# EAGLE design telakone-aux-gps (EAGLE 7.7.0)

## Sheet 1 of 5: POWER
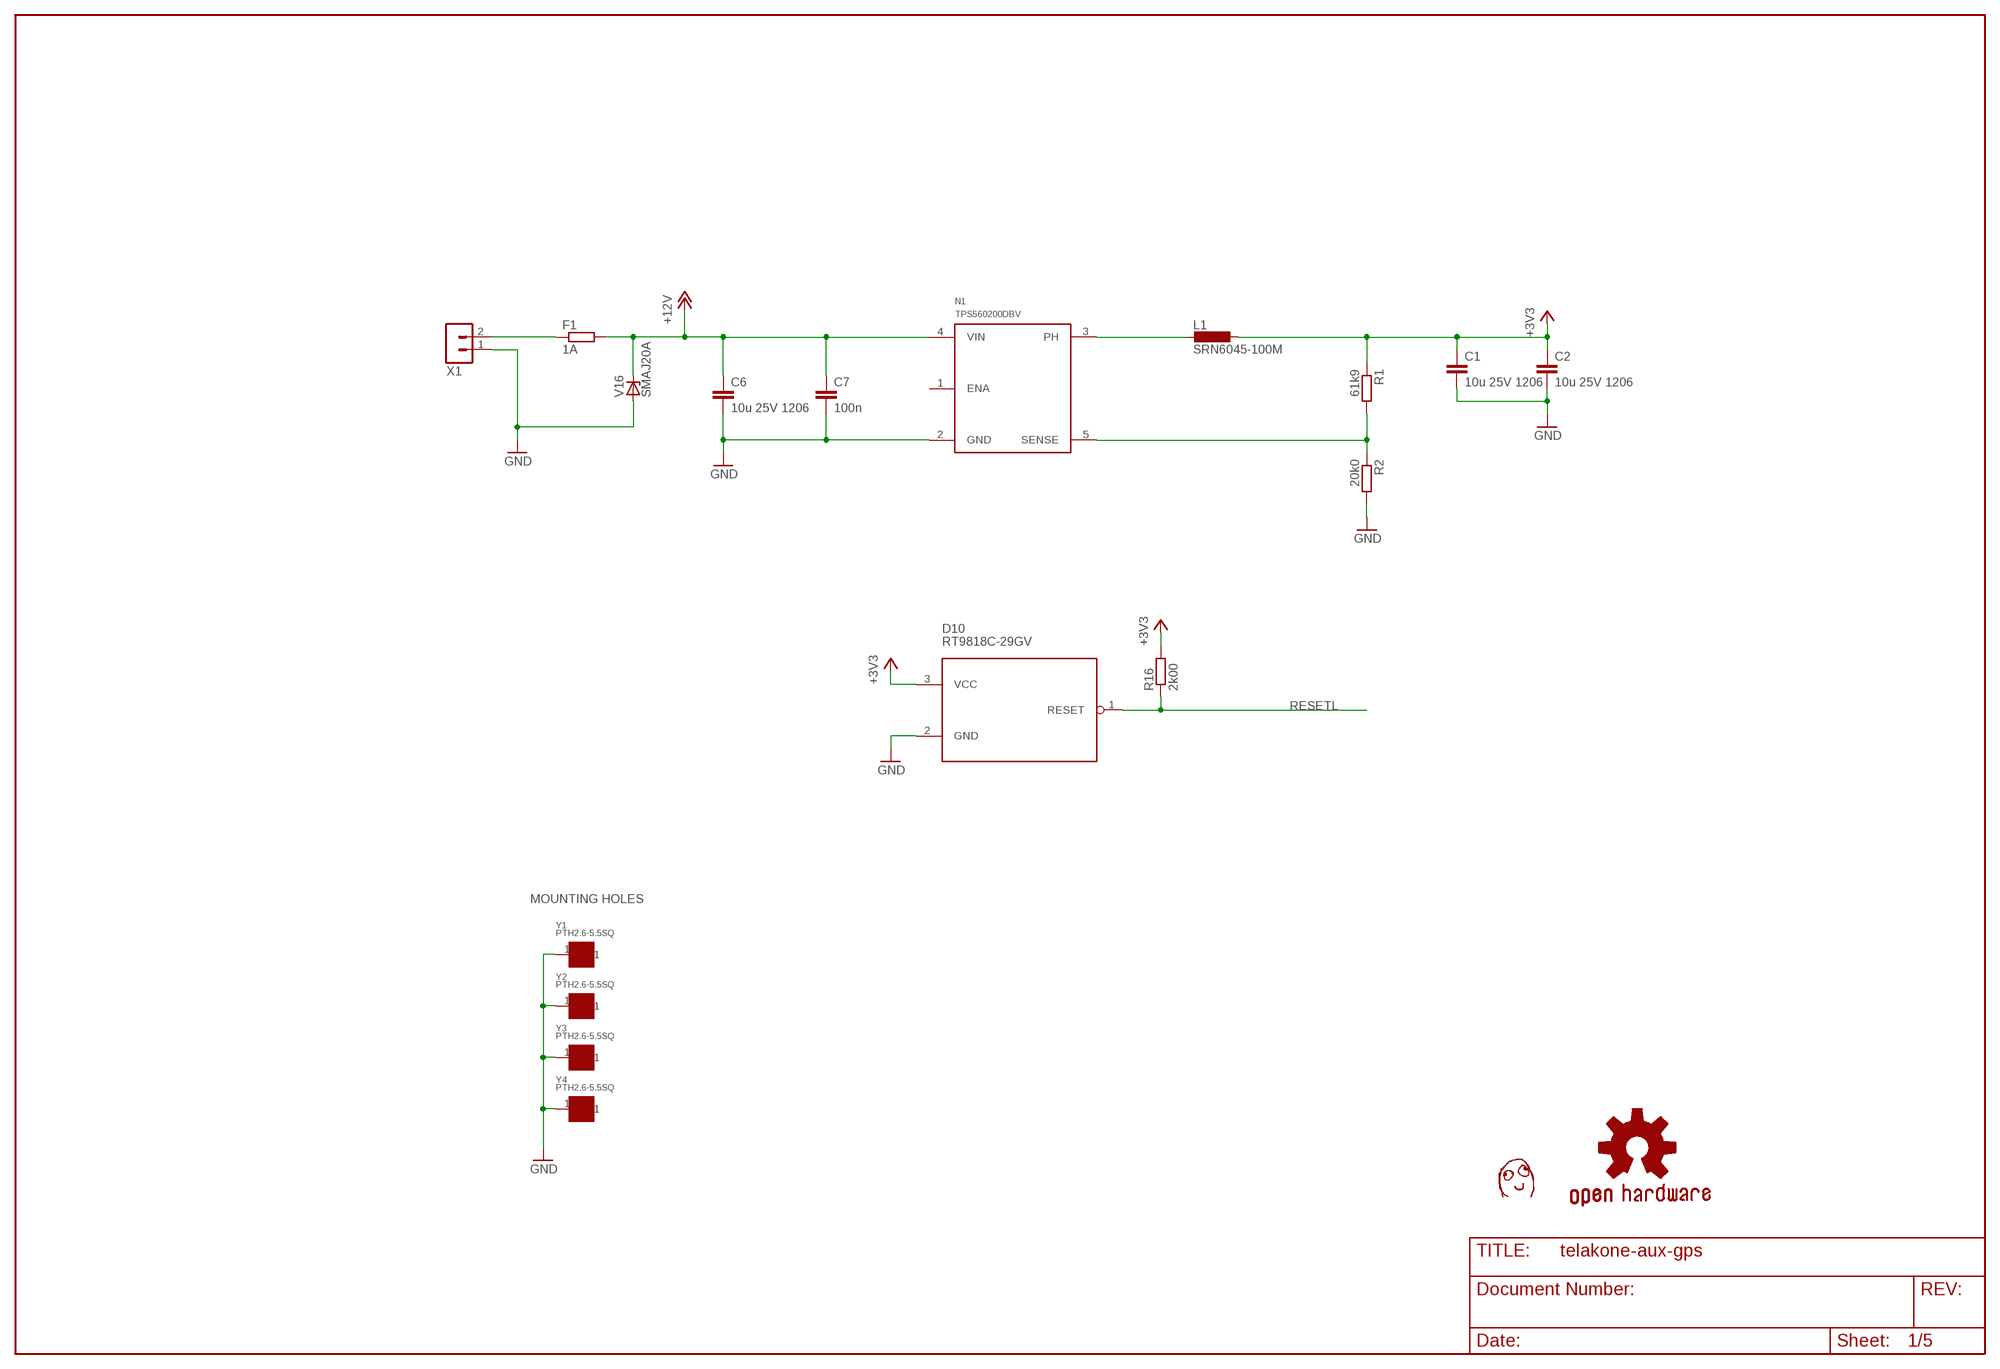
[diagram p0: schematic, sheet 1]

### Parts
C1  10u 25V 1206  CAP1206  [C1206]
C2  10u 25V 1206  CAP1206  [C1206]
C6  10u 25V 1206  CAP1206  [C1206]
C7  100n  CAP0603  [C0603]
D10  RT9818C-29GV  [SOT23]
F1  1A  RES1206  [R1206]
L1  SRN6045-100M  [SRN6045]
N1  TPS560200DBV  [SOT95P280X145-5N]
R1  61k9  RES0603  [R0603]
R2  20k0  RES0603  [R0603]
R16  2k00  RES0603  [R0603]
U$5  DAFUG  [DAFUG]
V16  SMAJ20A  SMAJXXA  [DO214AC]
X1  TE_RUUVILIITIN2  [TE_RUUVILIITIN2]
Y1  PTH2.6-5.5SQ  [PTH-2.6-5.5SQ]
Y2  PTH2.6-5.5SQ  [PTH-2.6-5.5SQ]
Y3  PTH2.6-5.5SQ  [PTH-2.6-5.5SQ]
Y4  PTH2.6-5.5SQ  [PTH-2.6-5.5SQ]

### Nets
+3V3 [supply]: C1.1 C2.1 D10.3(VCC) L1.1 R1.1 R16.2 ; also sheet 2,3,4,5
+12V [power]: C6.1 C7.1 F1.2 N1.4(VIN) V16.C ; also sheet 2,3
+12V_IN [power]: F1.1 X1.2
GND [other]: C1.2 C2.2 C6.2 C7.2 D10.2(GND) N1.2(GND) R2.2 V16.A X1.1 Y1.1 Y2.1 Y3.1 Y4.1 ; also sheet 2,3,4,5
N1_PHASE: L1.2 N1.3(PH)
N1_SENSE: N1.5(SENSE) R1.2 R2.1
RESETL: D10.1(RESET) R16.1 ; also sheet 3
Unconnected: N1.1(ENA)

### Notes on the sheet
- MOUNTING HOLES

## Sheet 2 of 5: IO
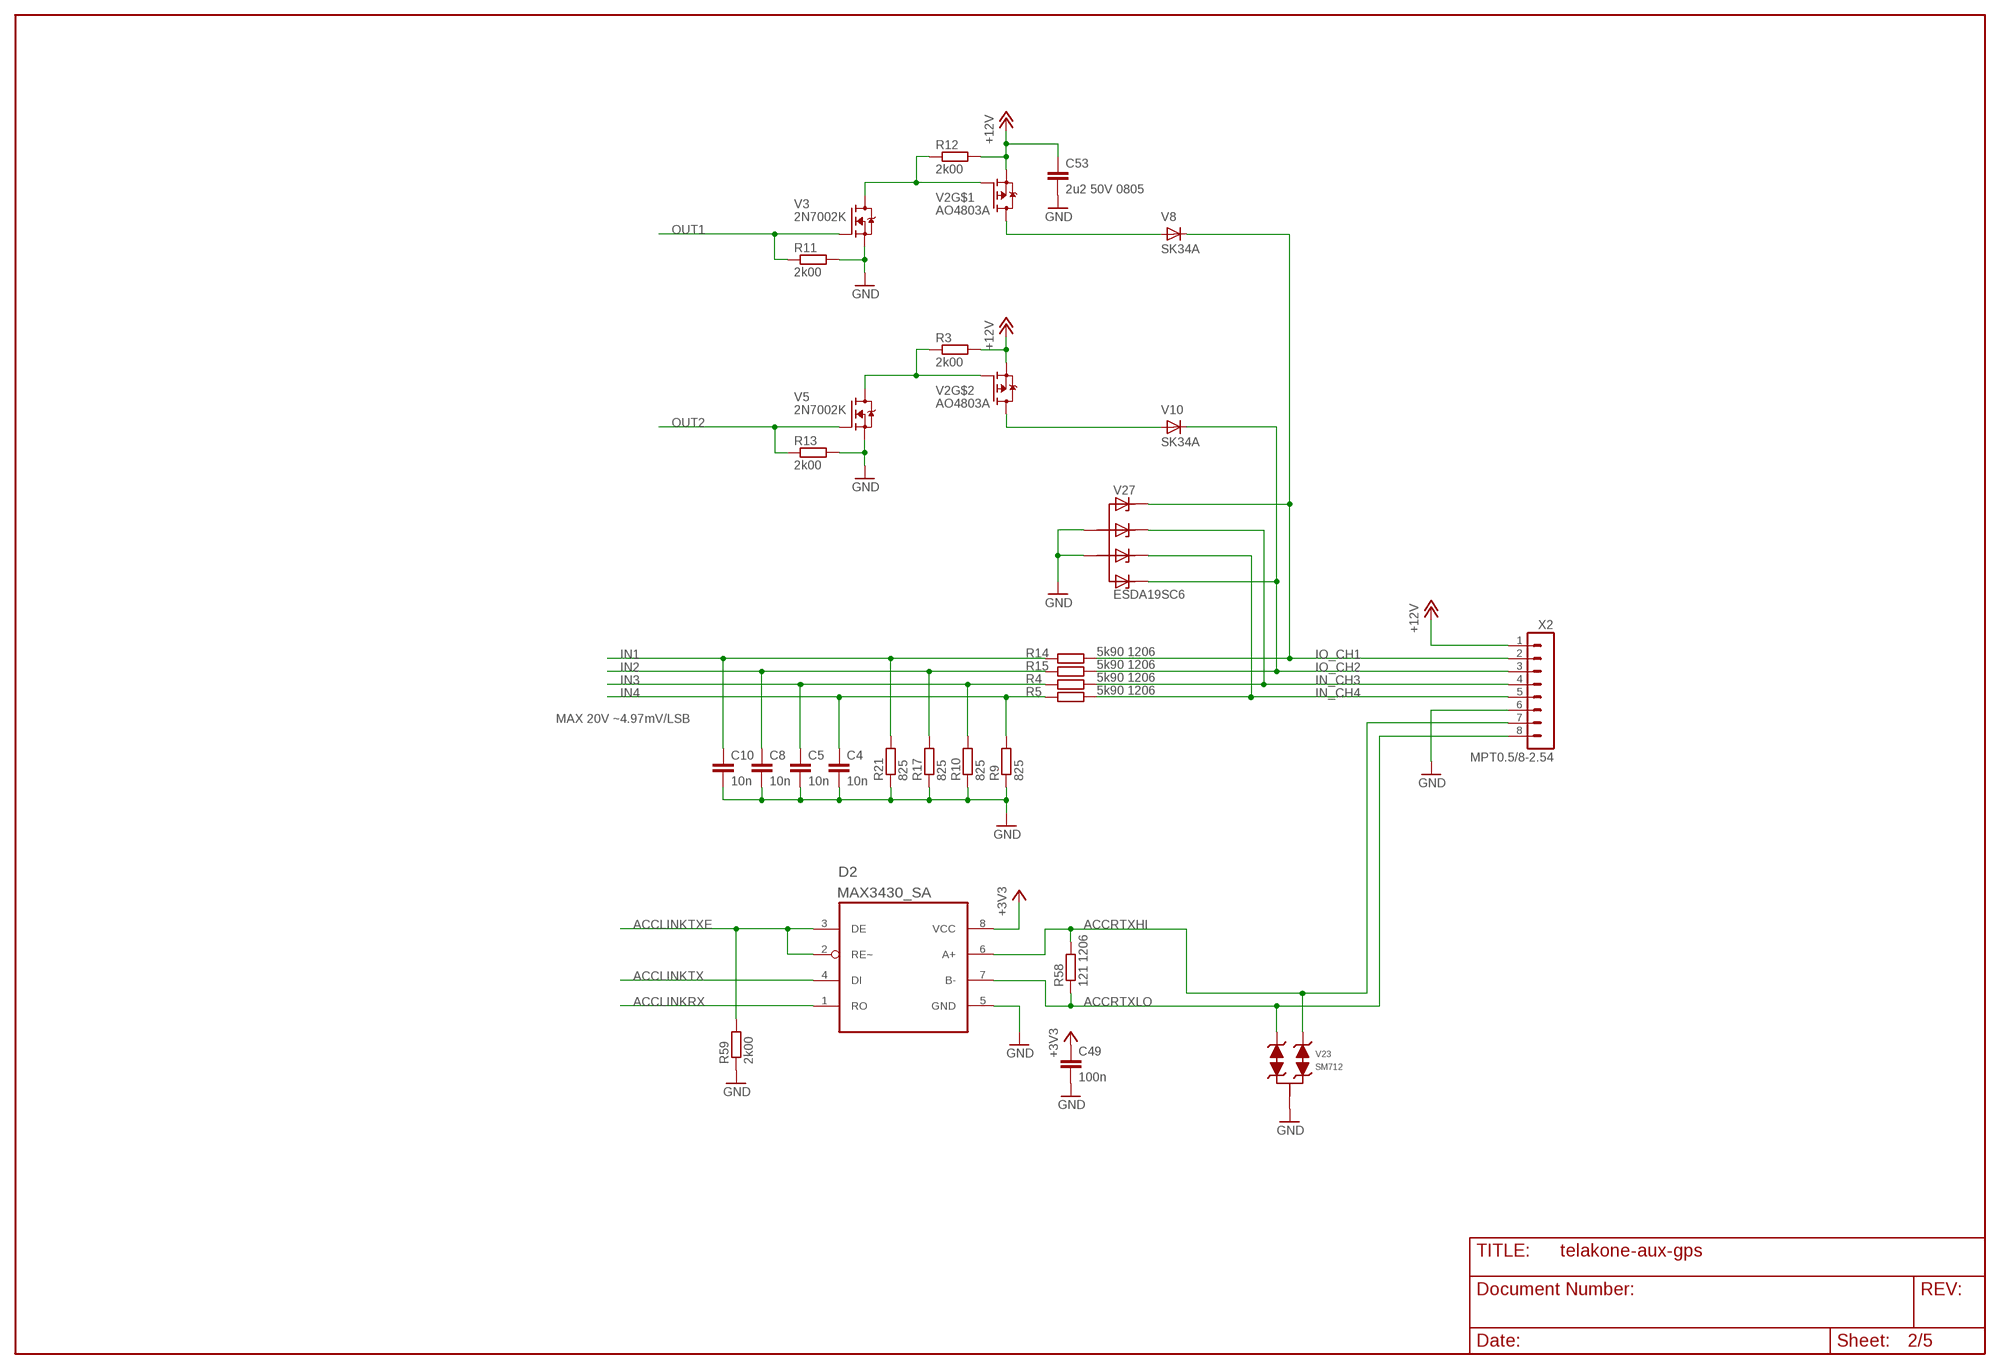
[diagram p1: schematic, sheet 2]

### Parts
C4  10n  CAP0603  [C0603]
C5  10n  CAP0603  [C0603]
C8  10n  CAP0603  [C0603]
C10  10n  CAP0603  [C0603]
C49  100n  CAP0603  [C0603]
C53  2u2 50V 0805  CAP0805  [C0805]
D2  MAX3430_SA  MAX3088_SA  [SOIC8-N_MC]
R3  2k00  RES0603  [R0603]
R4  5k90 1206  RES1206  [R1206]
R5  5k90 1206  RES1206  [R1206]
R9  825  RES0603  [R0603]
R10  825  RES0603  [R0603]
R11  2k00  RES0603  [R0603]
R12  2k00  RES0603  [R0603]
R13  2k00  RES0603  [R0603]
R14  5k90 1206  RES1206  [R1206]
R15  5k90 1206  RES1206  [R1206]
R17  825  RES0603  [R0603]
R21  825  RES0603  [R0603]
R58  121 1206  RES1206  [R1206]
R59  2k00  RES0603  [R0603]
V2  AO4803A  [SOIC8-N_MC]
V3  2N7002K  [SOT23]
V5  2N7002K  [SOT23]
V8  SK34A  [DO214AC]
V10  SK34A  [DO214AC]
V23  SM712  [SOT23]
V27  ESDA19SC6  ESDAXXSC6  [SOT23-6]
X2  MPT0.5/8-2.54  [MPT0.5/8-2.54]

### Nets
+3V3 [supply]: C49.1 D2.8(VCC) ; also sheet 1,3,4,5
+12V [power]: C53.1 R3.2 R12.2 V2.1(S) V2.3(S) X2.1 ; also sheet 1,3
ACCLINKRX: D2.1(RO) ; also sheet 4
ACCLINKTX: D2.4(DI) ; also sheet 4
ACCLINKTXE: D2.2(RE~) D2.3(DE) R59.2 ; also sheet 4
ACCRTXHI: D2.6(A+) R58.2 V23.1 X2.7
ACCRTXLO: D2.7(B-) R58.1 V23.2 X2.8
GND [other]: C4.2 C5.2 C8.2 C10.2 C49.2 C53.2 D2.5(GND) R9.1 R10.1 R11.2 R13.2 R17.1 R21.1 R59.1 V3.2(S) V5.2(S) V23.3 V27.2(A) V27.5(A1) X2.6 ; also sheet 1,3,4,5
IN1: C10.1 R14.1 R21.2 ; also sheet 4
IN2: C8.1 R15.1 R17.2 ; also sheet 4
IN3: C5.1 R4.1 R10.2 ; also sheet 4
IN4: C4.1 R5.1 R9.2 ; also sheet 4
IN_CH3: R4.2 V27.3(C1) X2.4
IN_CH4: R5.2 V27.4(C2) X2.5
IO_CH1: R14.2 V8.C V27.1(C) X2.2
IO_CH2: R15.2 V10.C V27.6(C3) X2.3
N$10: R3.1 V2.2(G) V5.3(D)
N$11: R12.1 V2.4(G) V3.3(D)
NERT: V2.5(D) V2.6(D) V8.A
NERT1: V2.7(D) V2.8(D) V10.A
OUT1: R11.1 V3.1(G) ; also sheet 4
OUT2: R13.1 V5.1(G) ; also sheet 4

### Notes on the sheet
- MAX 20V ~4.97mV/LSB

## Sheet 3 of 5: CPU1
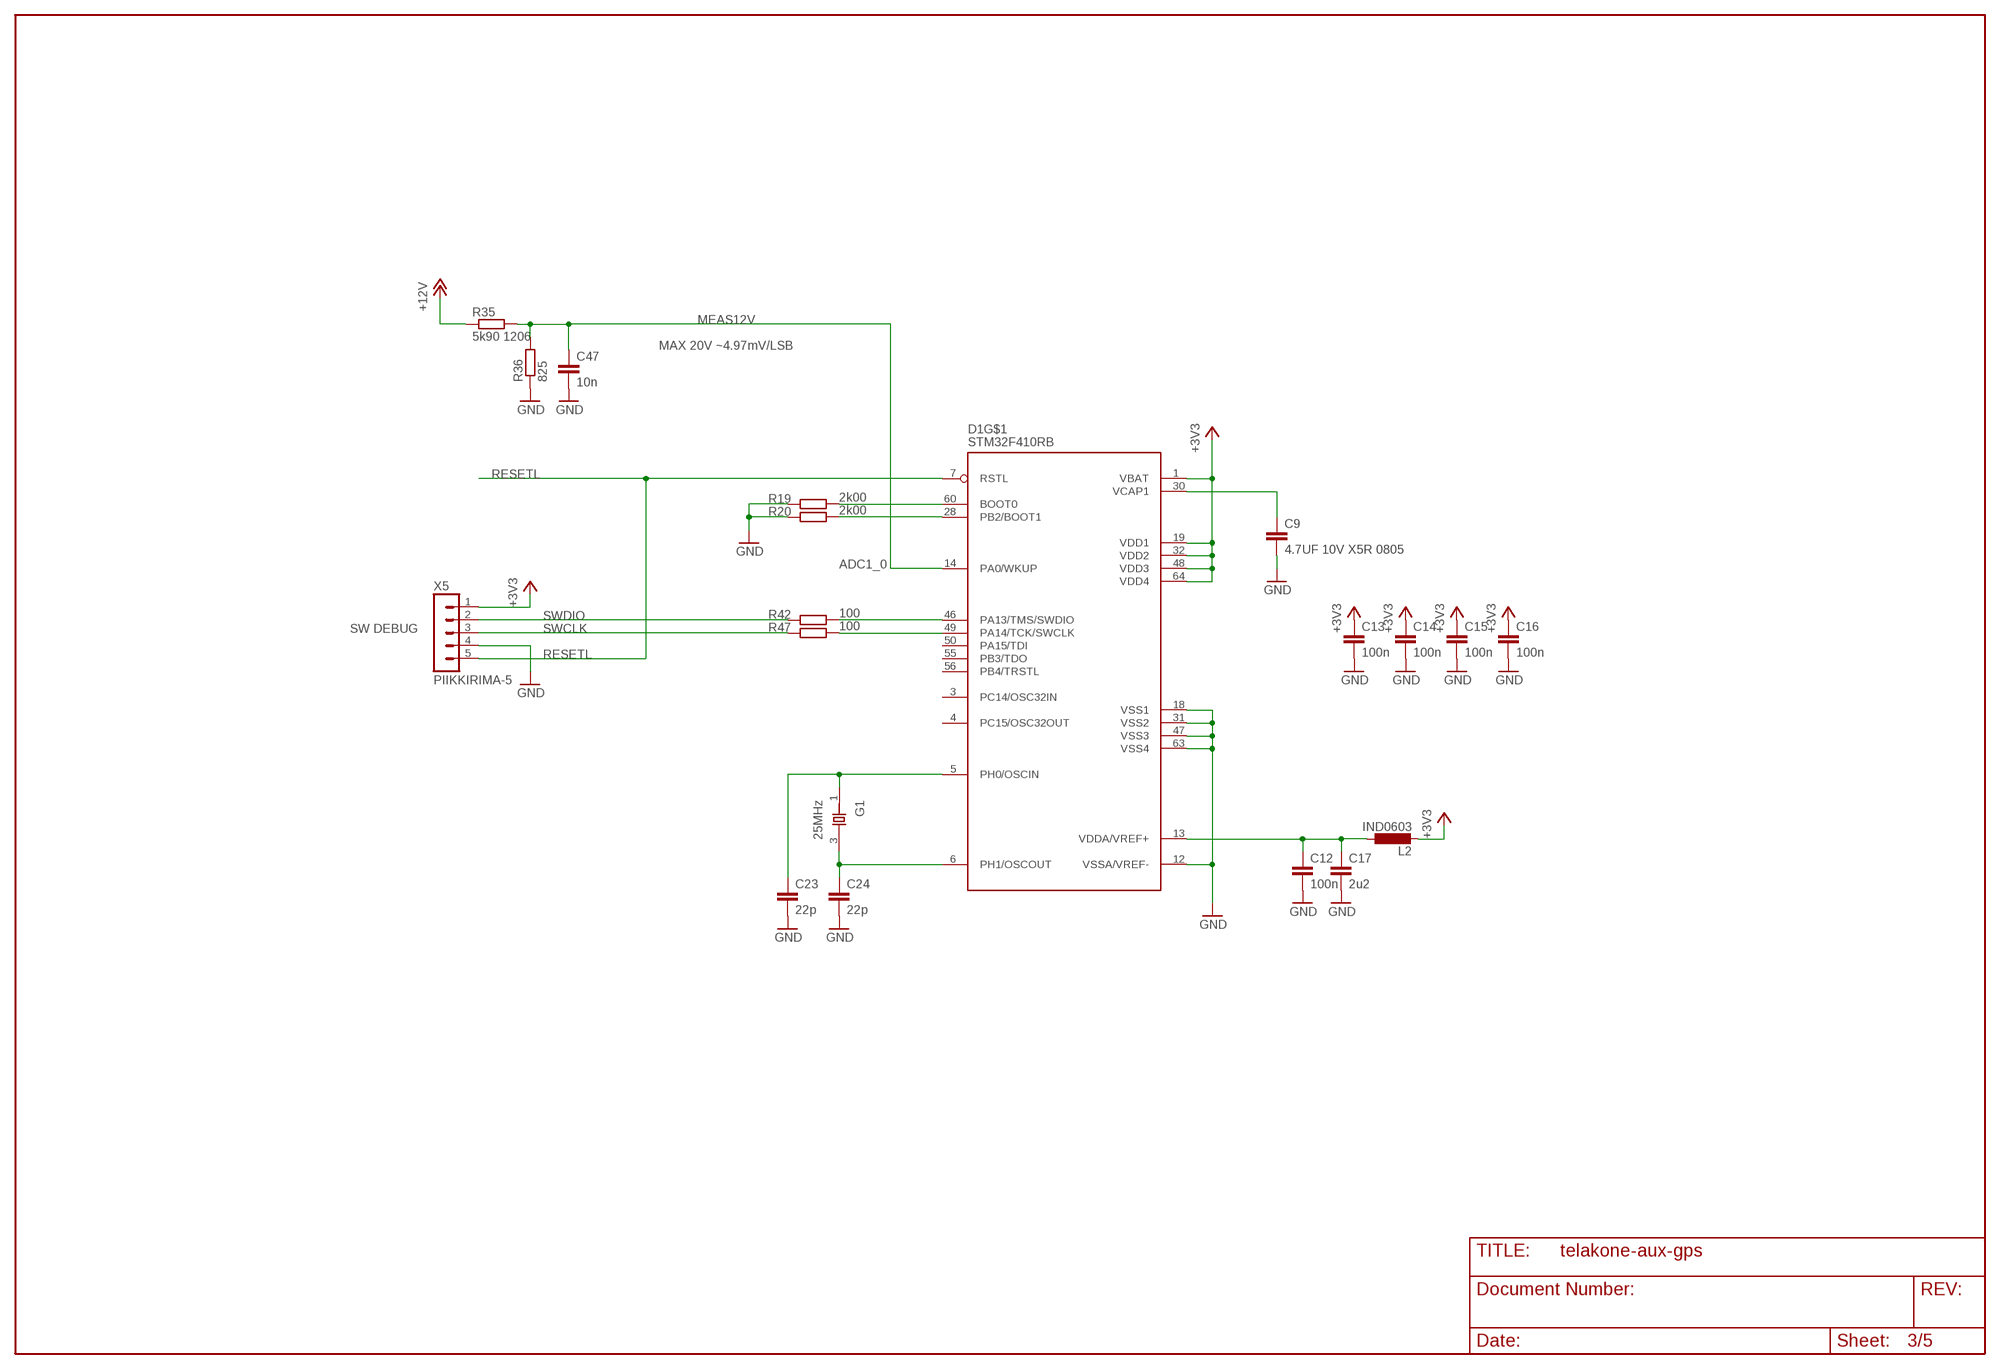
[diagram p2: schematic, sheet 3]

### Parts
C9  4.7UF 10V X5R 0805  CAP0805  [C0805]
C12  100n  CAP0603  [C0603]
C13  100n  CAP0603  [C0603]
C14  100n  CAP0603  [C0603]
C15  100n  CAP0603  [C0603]
C16  100n  CAP0603  [C0603]
C17  2u2  CAP0603  [C0603]
C23  22p  CAP0603  [C0603]
C24  22p  CAP0603  [C0603]
C47  10n  CAP0603  [C0603]
D1  STM32F410RB  [LQFP-64]
G1  25MHz  XTAL_3225_SMD  [X_3225]
L2  IND0603  [R0603]
R19  2k00  RES0603  [R0603]
R20  2k00  RES0603  [R0603]
R35  5k90 1206  RES1206  [R1206]
R36  825  RES0603  [R0603]
R42  100  RES0603  [R0603]
R47  100  RES0603  [R0603]
X5  PIIKKIRIMA-5  [PIIKKIRIMA-5]

### Nets
+3V3 [supply]: C13.1 C14.1 C15.1 C16.1 D1.1(VBAT) D1.19(VDD1) D1.32(VDD2) D1.48(VDD3) D1.64(VDD4) L2.2 X5.1 ; also sheet 1,2,4,5
+12V [power]: R35.1 ; also sheet 1,2
BOOT0: D1.60(BOOT0) R19.2
BOOT1: D1.28(PB2/BOOT1) R20.2
GND [other]: C9.2 C12.2 C13.2 C14.2 C15.2 C16.2 C17.2 C23.2 C24.2 C47.2 D1.12(VSSA/VREF-) D1.18(VSS1) D1.31(VSS2) D1.47(VSS3) D1.63(VSS4) R19.1 R20.1 R36.1 X5.4 ; also sheet 1,2,4,5
MEAS12V: C47.1 D1.14(PA0/WKUP) R35.2 R36.2
OSCIN: C23.1 D1.5(PH0/OSCIN) G1.1(X1)
OSCOUT: C24.1 D1.6(PH1/OSCOUT) G1.3(X2)
RESETL: D1.7(RSTL) X5.5 ; also sheet 1
SWCLK: R47.1 X5.3
SWCLK_CPU: D1.49(PA14/TCK/SWCLK) R47.2
SWDIO: R42.1 X5.2
SWDIO_CPU: D1.46(PA13/TMS/SWDIO) R42.2
VCAP1: C9.1 D1.30(VCAP1)
VDDA: C12.1 C17.1 D1.13(VDDA/VREF+) L2.1
Unconnected: D1.3(PC14/OSC32IN) D1.4(PC15/OSC32OUT) D1.50(PA15/TDI) D1.55(PB3/TDO) D1.56(PB4/TRSTL)

### Notes on the sheet
- MAX 20V ~4.97mV/LSB
- ADC1_0
- SW DEBUG

## Sheet 4 of 5: CPU2
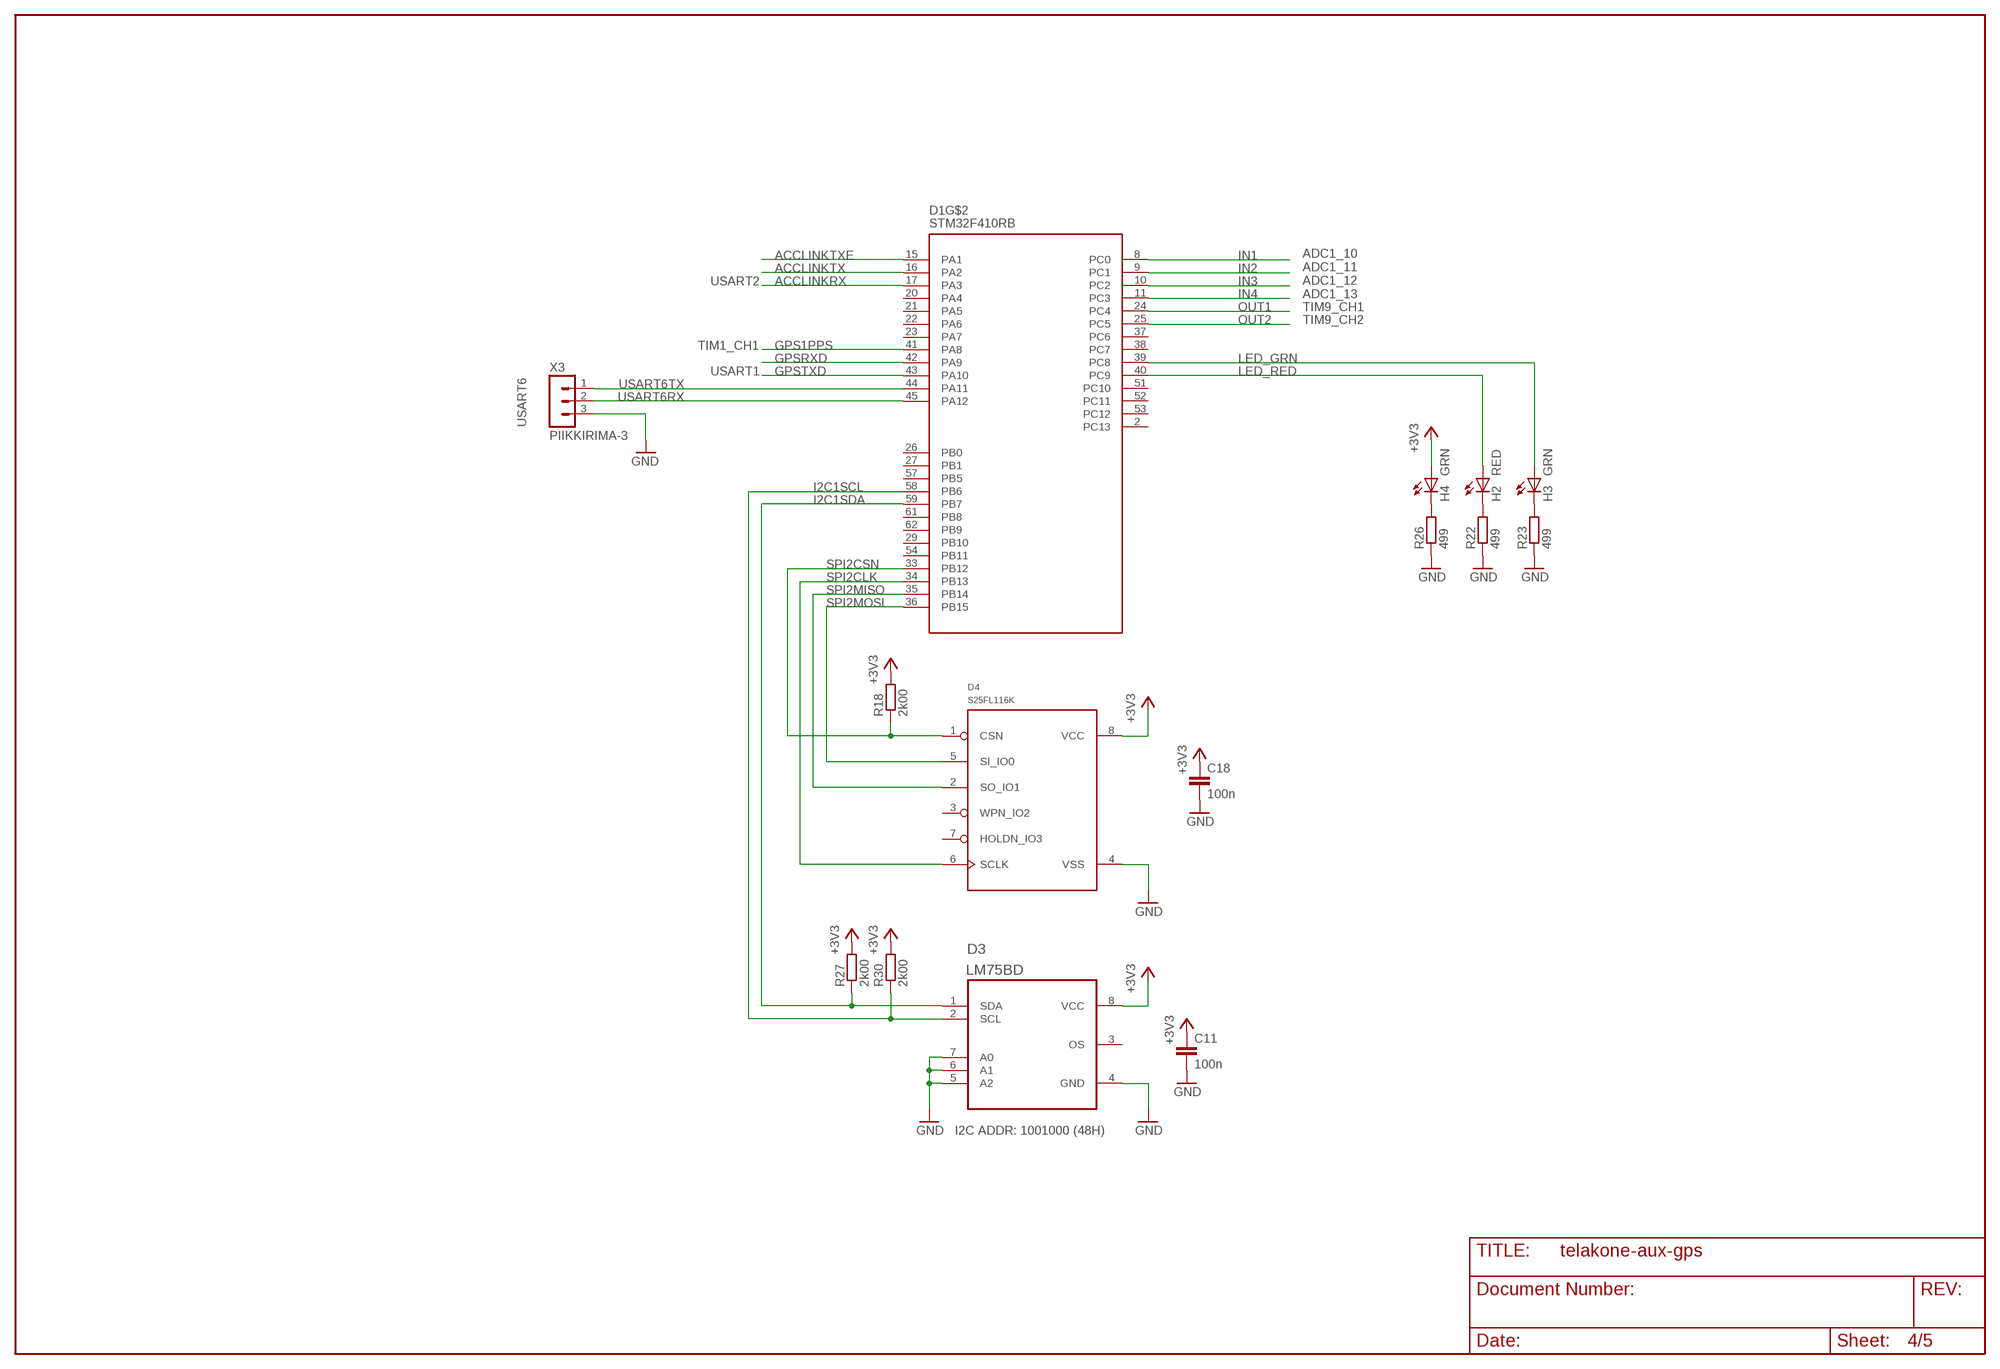
[diagram p3: schematic, sheet 4]

### Parts
C11  100n  CAP0603  [C0603]
C18  100n  CAP0603  [C0603]
D3  LM75BD  [SOIC8-N_MC]
D4  S25FL116K  [SOIC8-N_MC]
H2  RED  LEDCHIP-LED0603  [CHIP-LED0603]
H3  GRN  LEDCHIP-LED0603  [CHIP-LED0603]
H4  GRN  LEDCHIP-LED0603  [CHIP-LED0603]
R18  2k00  RES0603  [R0603]
R22  499  RES0603  [R0603]
R23  499  RES0603  [R0603]
R26  499  RES0603  [R0603]
R27  2k00  RES0603  [R0603]
R30  2k00  RES0603  [R0603]
X3  PIIKKIRIMA-3  [PIIKKIRIMA-3]

### Nets
+3V3 [supply]: C11.1 C18.1 D3.8(VCC) D4.8(VCC) H4.A R18.2 R27.2 R30.2 ; also sheet 1,2,3,5
ACCLINKRX: D1.17(PA3) ; also sheet 2
ACCLINKTX: D1.16(PA2) ; also sheet 2
ACCLINKTXE: D1.15(PA1) ; also sheet 2
GND [other]: C11.2 C18.2 D3.4(GND) D3.5(A2) D3.6(A1) D3.7(A0) D4.4(VSS) R22.1 R23.1 R26.1 X3.3 ; also sheet 1,2,3,5
GPS1PPS: D1.41(PA8) ; also sheet 5
GPSRXD: D1.42(PA9) ; also sheet 5
GPSTXD: D1.43(PA10) ; also sheet 5
I2C1SCL: D1.58(PB6) D3.2(SCL) R30.1
I2C1SDA: D1.59(PB7) D3.1(SDA) R27.1
IN1: D1.8(PC0) ; also sheet 2
IN2: D1.9(PC1) ; also sheet 2
IN3: D1.10(PC2) ; also sheet 2
IN4: D1.11(PC3) ; also sheet 2
LED_GRN: D1.39(PC8) H3.A
LED_RED: D1.40(PC9) H2.A
N$2: H3.C R23.2
N$3: H2.C R22.2
N$5: H4.C R26.2
OUT1: D1.24(PC4) ; also sheet 2
OUT2: D1.25(PC5) ; also sheet 2
SPI2CLK: D1.34(PB13) D4.6(SCLK)
SPI2CSN: D1.33(PB12) D4.1(CSN) R18.1
SPI2MISO: D1.35(PB14) D4.2(SO_IO1)
SPI2MOSI: D1.36(PB15) D4.5(SI_IO0)
USART6RX: D1.45(PA12) X3.2
USART6TX: D1.44(PA11) X3.1
Unconnected: D1.2(PC13) D1.20(PA4) D1.21(PA5) D1.22(PA6) D1.23(PA7) D1.26(PB0) D1.27(PB1) D1.29(PB10) D1.37(PC6) D1.38(PC7) D1.51(PC10) D1.52(PC11) D1.53(PC12) D1.54(PB11) D1.57(PB5) D1.61(PB8) D1.62(PB9) D3.3(OS) D4.3(WPN_IO2) D4.7(HOLDN_IO3)

### Notes on the sheet
- USART2
- ADC1_10
  ADC1_11
  ADC1_12
  ADC1_13
- TIM9_CH1
- TIM9_CH2
- TIM1_CH1
- USART1
- USART6
- I2C ADDR: 1001000 (48H)

## Sheet 5 of 5: GPS
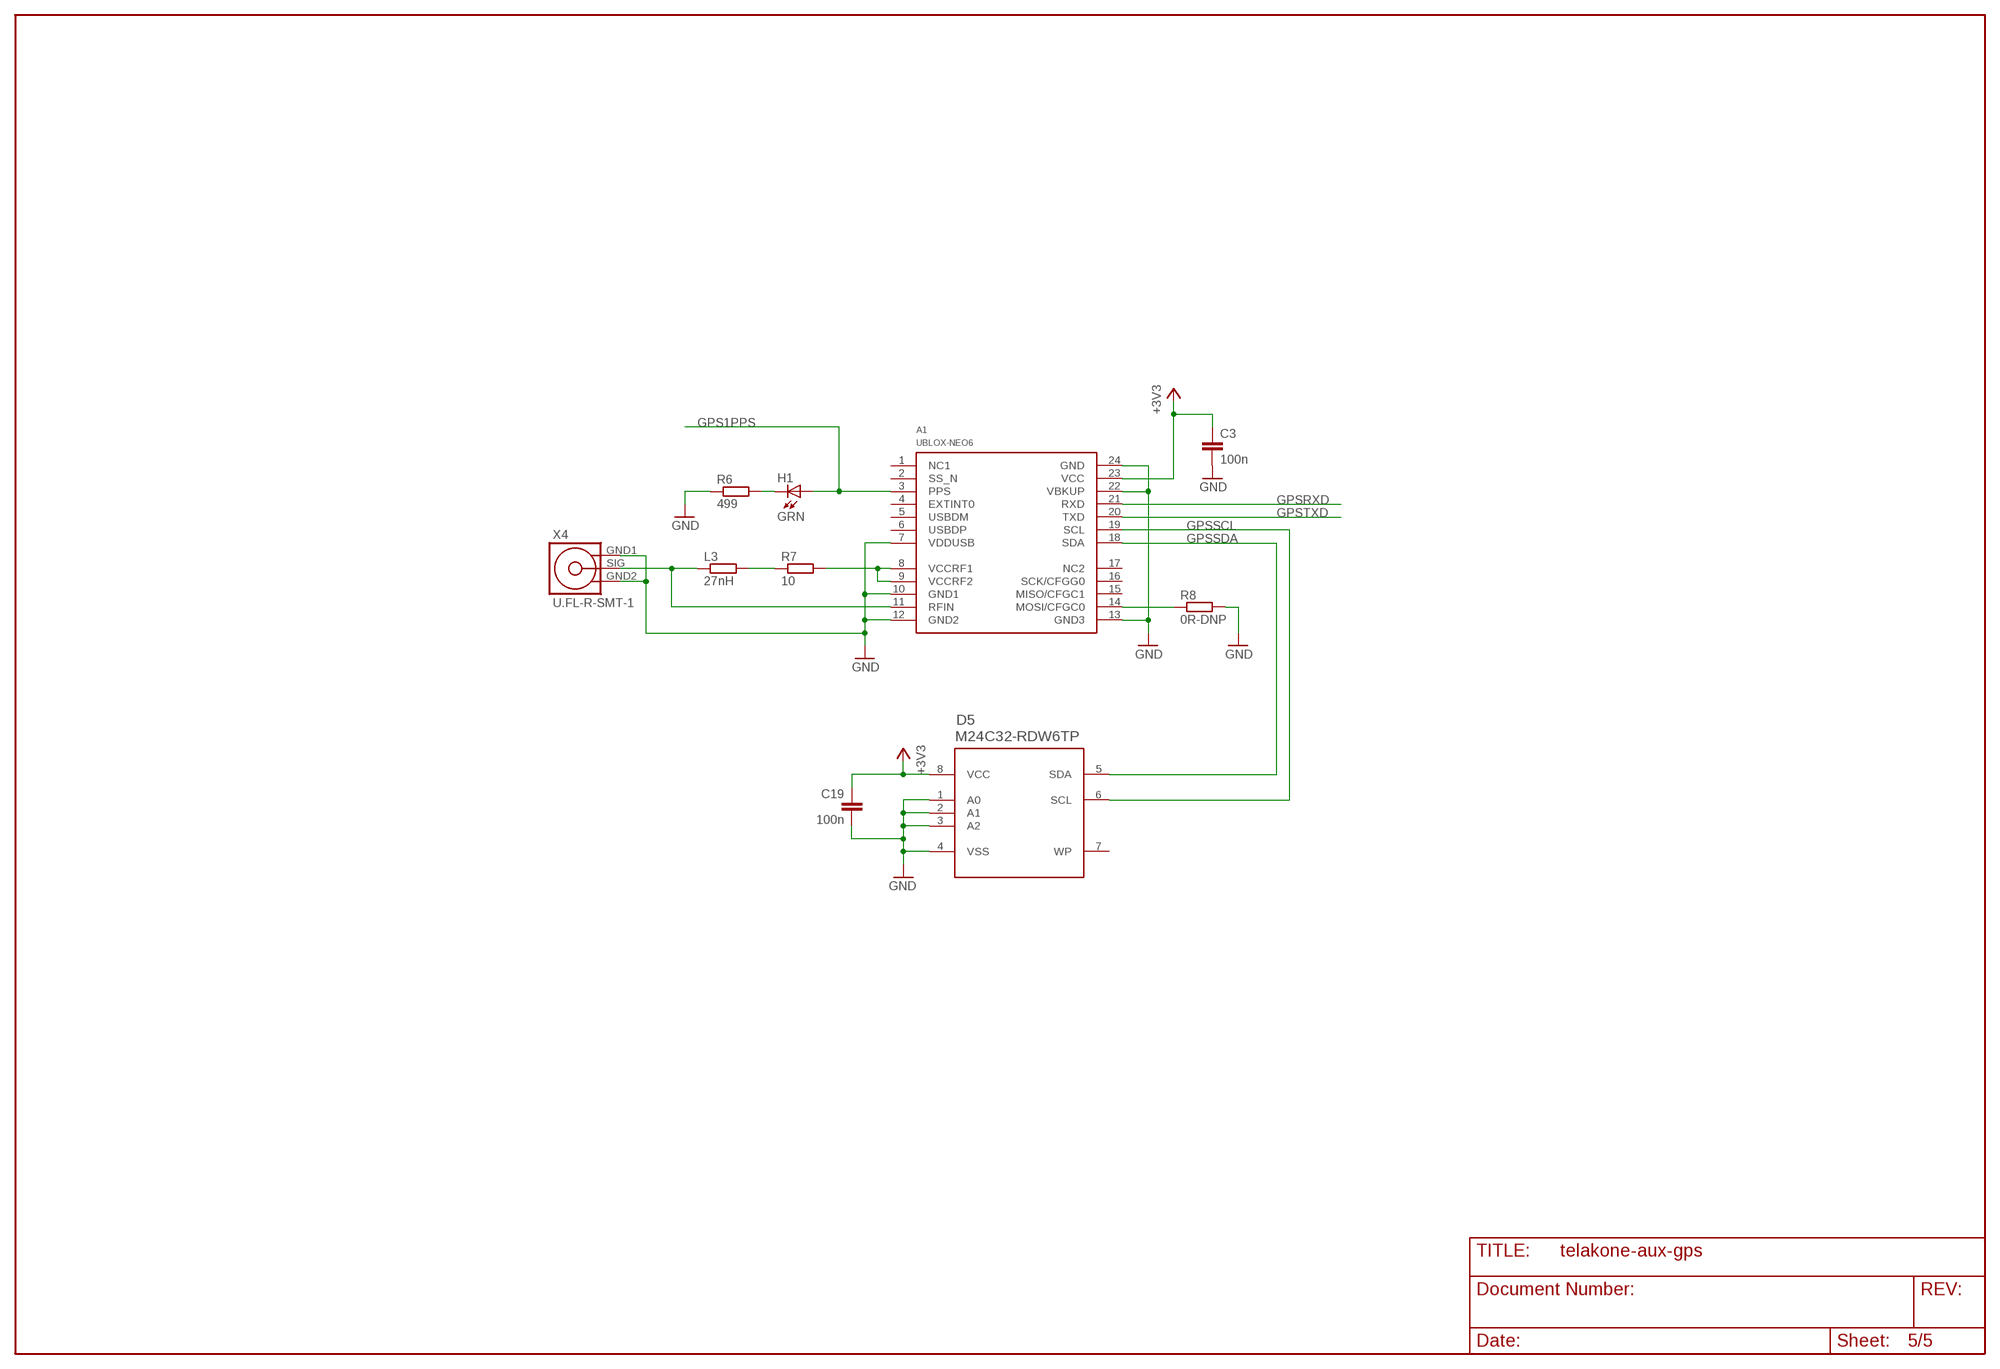
[diagram p4: schematic, sheet 5]

### Parts
A1  UBLOX-NEO6  [UBLOX-NEO6]
C3  100n  CAP0603  [C0603]
C19  100n  CAP0603  [C0603]
D5  M24C32-RDW6TP  [TSSOP8-66]
H1  GRN  LEDCHIP-LED0603  [CHIP-LED0603]
L3  27nH  RES0603  [R0603]
R6  499  RES0603  [R0603]
R7  10  RES0603  [R0603]
R8  0R-DNP  RES0603  [R0603]
X4  U.FL-R-SMT-1  [U.FL-R-SMT-1]

### Nets
+3V3 [supply]: A1.23(VCC) C3.1 C19.1 D5.8(VCC) ; also sheet 1,2,3,4
GND [other]: A1.7(VDDUSB) A1.10(GND1) A1.12(GND2) A1.13(GND3) A1.22(VBKUP) A1.24(GND) C3.2 C19.2 D5.1(A0) D5.2(A1) D5.3(A2) D5.4(VSS) R6.1 R8.2 X4.GND1 X4.GND2 ; also sheet 1,2,3,4
GPS1PPS: A1.3(PPS) H1.A ; also sheet 4
GPSRF: A1.11(RFIN) L3.1 X4.SIG
GPSRXD: A1.21(RXD) ; also sheet 4
GPSSCL: A1.19(SCL) D5.6(SCL)
GPSSDA: A1.18(SDA) D5.5(SDA)
GPSTXD: A1.20(TXD) ; also sheet 4
N$17: H1.C R6.2
N$20: L3.2 R7.1
N$21: A1.14(MOSI/CFGC0) R8.1
VCCRF: A1.8(VCCRF1) A1.9(VCCRF2) R7.2
Unconnected: A1.1(NC1) A1.2(SS_N) A1.4(EXTINT0) A1.5(USBDM) A1.6(USBDP) A1.15(MISO/CFGC1) A1.16(SCK/CFGG0) A1.17(NC2) D5.7(WP)

## Library data of the parts
A1 = omat_ic_2:UBLOX-NEO6
C1-C19 C23 C24 C47 C49 C53 = omat_ic_2:CAP
D1 = omat_ic_2:STM32F410RB
D2 = omat_ic_2:MAX3088_SA
D3 = omat_ic_2:LM75BD
D4 = omat_ic_2:S25FL116K
D5 = omat_ic_2:M24C32-RDW6TP
D10 = omat_ic_2:RT9818C-29GV
F1 L3 R1-R23 R26 R27 R30 R35 R36 R42 R47 R58 R59 = omat_ic_2:RES
G1 = omat_ic_2:XTAL_3225_SMD: CRYSTAL CLOCK OSCILLATORS 5.0 Vdc or 3.3 Vdc - LOW PROFILE ULTRA MINIATURE CERAMIC SURFACE MOUNT Source: http://www.abracon.com/Oscillators/asf1-L-L1.pdf
H1-H4 = omat_ic_2:LED: LED OSRAM: - CHIPLED LG R971, LG N971, LY N971, LG Q971, LY Q971, LO R971, LY R971 LH N974, LH R974 LS Q976, LO Q976, LY Q976 LO Q996 - Hyper CHIPLED LW Q18S LB Q993, LB Q99A, LB R99A - SideLED LS A670, LO A670, LY A670, LG A670, LP A670 LB A673, LV A673, LT A673, LW A673 LH A674 LY A675 LS A676, LA A676, LO A676, LY A676, LW A676 LS A679, LY A679, LG A679 - Hyper Micro SIDELED® LS Y876, LA Y876, LO Y876, LY Y876 LT Y87S - SmartLED LW L88C, LW L88S LB L89C, LB L89S, LG L890 LS L89K, LO L89K, LY L89K LS L896, LA L896, LO L896, LY L896 - TOPLED LS T670, LO T670, LY T670, LG T670, LP T670 LSG T670, LSP T670, LSY T670, LOP T670, LYG T670 LG T671, LOG T671, LSG T671 LB T673, LV T673, LT T673, LW T673 LH T674 LS T676, LA T676, LO T676, LY T676, LB T676, LH T676, LSB T676, LW T676 LB T67C, LV T67C, LT T67C, LS T67K, LO T67K, LY T67K, LW E67C LS E67B, LA E67B, LO E67B, LY E67B, LB E67C, LV E67C, LT E67C LW T67C LS T679, LY T679, LG T679 LS T770, LO T770, LY T770, LG T770, LP T770 LB T773, LV T773, LT T773, LW T773 LH T774 LS E675, LA E675, LY E675, LS T675 LS T776, LA T776, LO T776, LY T776, LB T776 LHGB T686 LT T68C, LB T68C - Hyper Mini TOPLED® LB M676 - Mini TOPLED Santana® LG M470 LS M47K, LO M47K, LY M47K Source: http://www.osram.convergy.de LUXEON: - LUMILED® LXK2-PW12-R00, LXK2-PW12-S00, LXK2-PW14-U00, LXK2-PW14-V00 LXK2-PM12-R00, LXK2-PM12-S00, LXK2-PM14-U00 LXK2-PE12-Q00, LXK2-PE12-R00, LXK2-PE12-S00, LXK2-PE14-T00, LXK2-PE14-U00 LXK2-PB12-K00, LXK2-PB12-L00, LXK2-PB12-M00, LXK2-PB14-N00, LXK2-PB14-P00, LXK2-PB14-Q00 LXK2-PR12-L00, LXK2-PR12-M00, LXK2-PR14-Q00, LXK2-PR14-R00 LXK2-PD12-Q00, LXK2-PD12-R00, LXK2-PD12-S00 LXK2-PH12-R00, LXK2-PH12-S00 LXK2-PL12-P00, LXK2-PL12-Q00, LXK2-PL12-R00 Source: www.luxeon.com KINGBRIGHT: KA-3528ASYC Source: www.kingbright.com
L1 = omat_ic_2:SRN6045
L2 = omat_ic_2:IND
N1 = omat_ic_2:TPS560200DBV
U$5 = dafug:DAFUG
V2 = omat_ic_2:AO4803A
V3 V5 = omat_ic_2:2N7002K
V8 V10 = omat_ic_2:SK34A
V16 = omat_ic_2:SMAJXXA
V23 = omat_ic_2:SM712
V27 = omat_ic_2:ESDAXXSC6
X1 = omat_ic_2:TE_RUUVILIITIN2
X2 = omat_ic_2:MPT0.5/8-2.54
X3 = omat_ic_2:PIIKKIRIMA-3
X4 = omat_ic_2:U.FL-R-SMT-1
X5 = omat_ic_2:PIIKKIRIMA-5
Y1-Y4 = EKE:PTH

## Net classes
2 other: width 0.3 mm, drill 0.3 mm, clearance 1 mm to class 1
3 supply: width 0.3 mm, drill 0.3 mm
4 power: width 0.5 mm, drill 0.5 mm

## Board
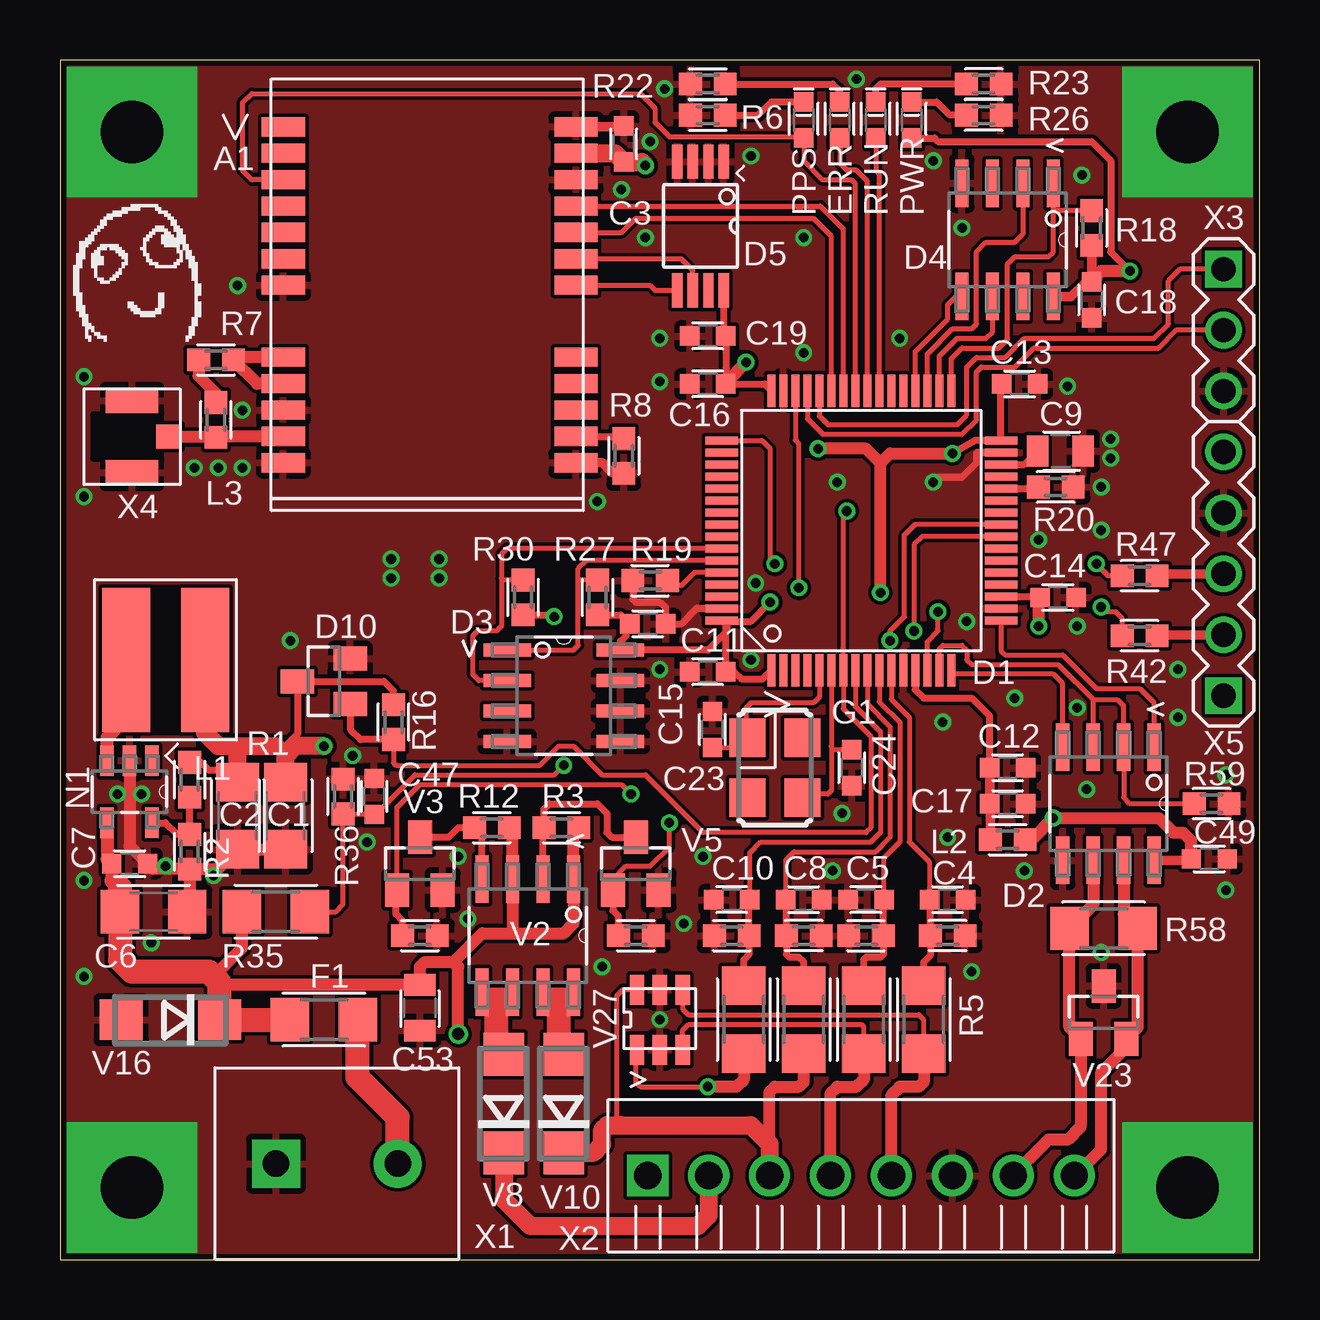
[diagram p5: board, top side]
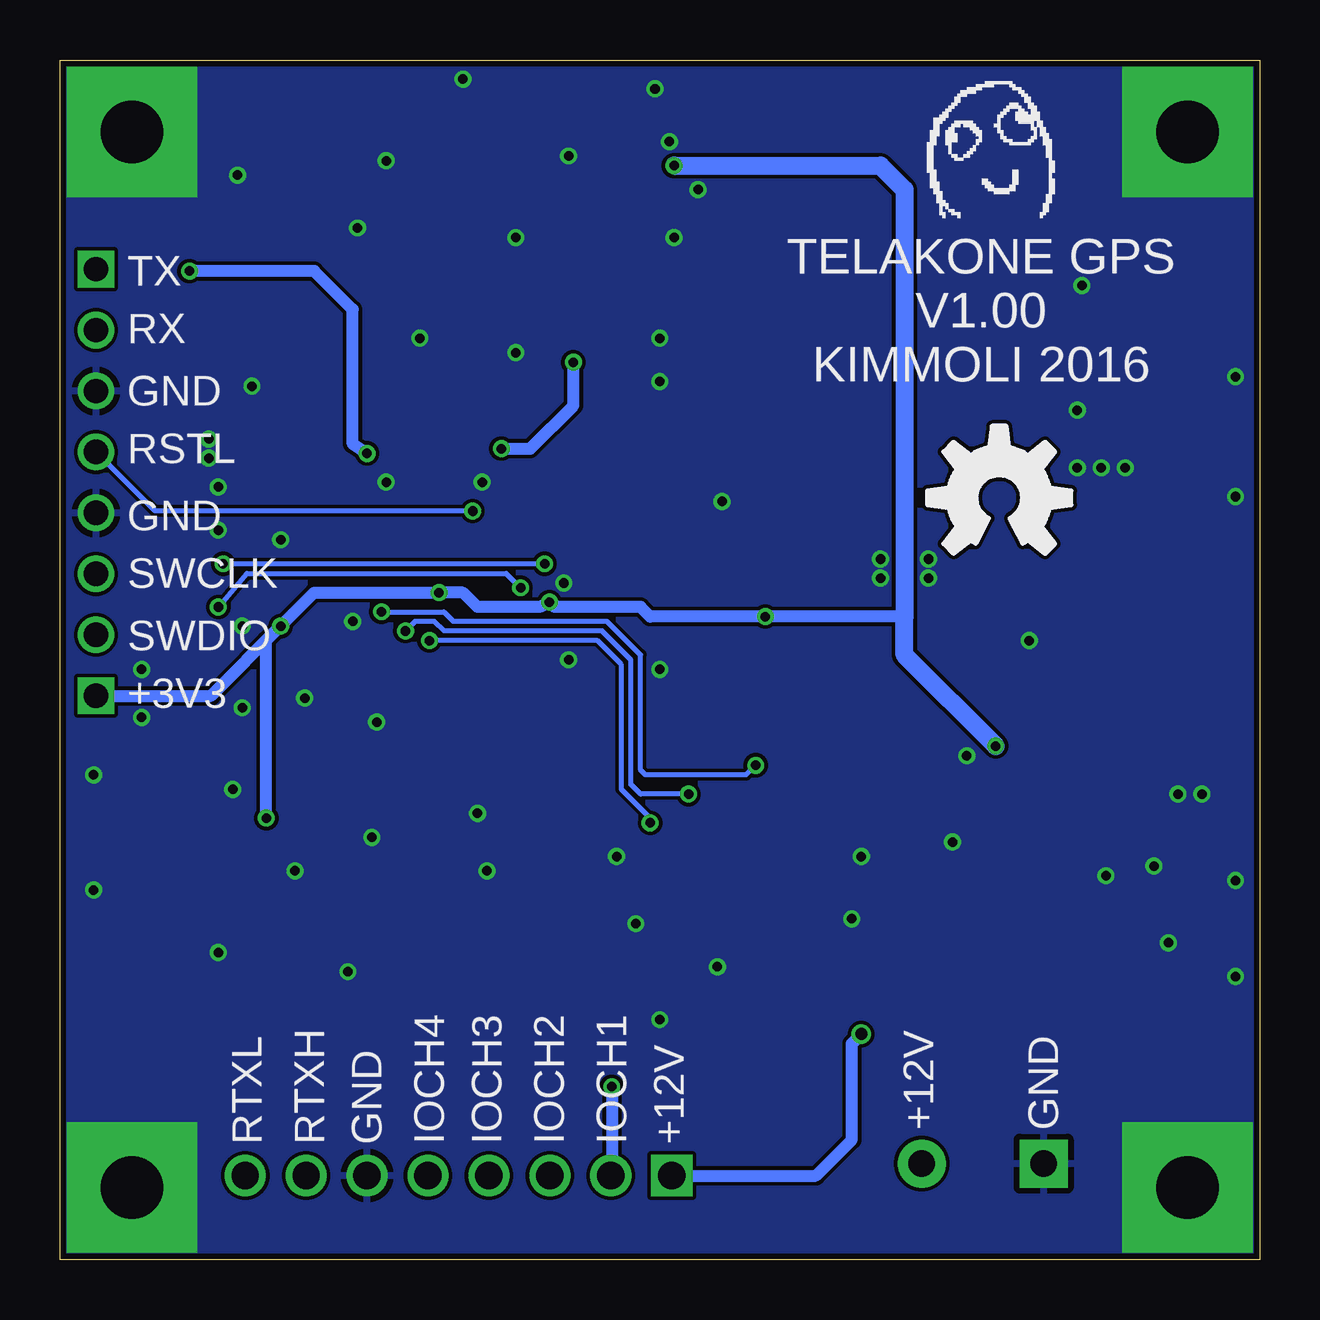
[diagram p6: board, bottom side, seen from below]

Size 50 x 50 mm. Coordinates in mm from the lower left corner, seen from the top.
Outline: 0,0 50,0 50,50 0,50 0,0
Copper layers (1*16): Top 0.035mm / dielectric 1.5mm / Bottom 0.035mm
Design rules "ITEADstudio_DRC": minimum track width 6mil, minimum drill 12mil, track to track 6mil, track to pad 6mil, pad to pad 6mil, via to via 6mil, smd to smd 0mil, copper to edge 10mil, drill to drill 10mil, minimum pad ring 10mil, minimum via ring 6mil, stop-mask expansion 2mil, vias tented up to drill 100mil, thermal gap 10mil
tRestrict: area 1.4,33.4 to 3.8,35.2; area 1.8,22 to 7,28

### Footprints (pad centres in the part's own frame; a part is rotated, then mirrored left to right if it is on the bottom)
UBLOX-NEO6 = smd 0.8 x 1.8: 1 0,0; 2 1.1,0; 3 2.2,0; 4 3.3,0; 5 4.4,0; 6 5.5,0; 7 6.6,0; 8 9.6,0; 9 10.7,0; 10 11.8,0; 11 12.9,0; 12 14,0; 13 14,12.2; 14 12.9,12.2; 15 11.8,12.2; 16 10.7,12.2; 17 9.6,12.2; 18 6.6,12.2; 19 5.5,12.2; 20 4.4,12.2; 21 3.3,12.2; 22 2.2,12.2; 23 1.1,12.2; 24 0,12.2
C1206 = smd 1.6 x 1.8: 1 -1.4,0; 2 1.4,0
C0603 = smd 0.8 x 0.8: 1 -0.75,0; 2 0.75,0
C0805 = smd 0.9 x 1.3: 1 -0.95,0; 2 0.95,0
LQFP-64 = smd 0.34 x 1.35: 1 -3.75,-5.825; 2 -3.25,-5.825; 3 -2.75,-5.825; 4 -2.25,-5.825; 5 -1.75,-5.825; 6 -1.25,-5.825; 7 -0.75,-5.825; 8 -0.25,-5.825; 9 0.25,-5.825; 10 0.75,-5.825; 11 1.25,-5.825; 12 1.75,-5.825; 13 2.25,-5.825; 14 2.75,-5.825; 15 3.25,-5.825; 16 3.75,-5.825; 33 3.75,5.825; 34 3.25,5.825; 35 2.75,5.825; 36 2.25,5.825; 37 1.75,5.825; 38 1.25,5.825; 39 0.75,5.825; 40 0.25,5.825; 41 -0.25,5.825; 42 -0.75,5.825; 43 -1.25,5.825; 44 -1.75,5.825; 45 -2.25,5.825; 46 -2.75,5.825; 47 -3.25,5.825; 48 -3.75,5.825 | smd 1.35 x 0.34: 17 5.825,-3.75; 18 5.825,-3.25; 19 5.825,-2.75; 20 5.825,-2.25; 21 5.825,-1.75; 22 5.825,-1.25; 23 5.825,-0.75; 24 5.825,-0.25; 25 5.825,0.25; 26 5.825,0.75; 27 5.825,1.25; 28 5.825,1.75; 29 5.825,2.25; 30 5.825,2.75; 31 5.825,3.25; 32 5.825,3.75; 49 -5.825,3.75; 50 -5.825,3.25; 51 -5.825,2.75; 52 -5.825,2.25; 53 -5.825,1.75; 54 -5.825,1.25; 55 -5.825,0.75; 56 -5.825,0.25; 57 -5.825,-0.25; 58 -5.825,-0.75; 59 -5.825,-1.25; 60 -5.825,-1.75; 61 -5.825,-2.25; 62 -5.825,-2.75; 63 -5.825,-3.25; 64 -5.825,-3.75
SOIC8-N_MC = smd 1.981 x 0.559: 1 -2.362,1.905; 2 -2.362,0.635; 3 -2.362,-0.635; 4 -2.362,-1.905; 5 2.362,-1.905; 6 2.362,-0.635; 7 2.362,0.635; 8 2.362,1.905
TSSOP8-66 = smd 1.422 x 0.432: 1 -2.764,1.165; 2 -2.764,0.53; 3 -2.764,-0.13; 4 -2.764,-0.765; 5 2.604,-0.765; 6 2.604,-0.13; 7 2.604,0.53; 8 2.604,1.165
SOT23 = smd 1 x 1.4: 1 -0.95,-1.1; 2 0.95,-1.1; 3 0,1.1
R1206 = smd 1.6 x 1.803: 1 -1.422,0; 2 1.422,0
X_3225 = smd 1.6 x 1.5: 1 -1.25,-1.15; 2 1.25,-1.15; 3 1.25,1.15; 4 -1.25,1.15
CHIP-LED0603 = smd 0.8 x 0.8: A -0.75,0; C 0.75,0
SRN6045 = smd 2 x 6: 1 -1.65,0; 2 1.65,0
R0603 = smd 0.95 x 0.95: 1 -0.725,0; 2 0.725,0
SOT95P280X145-5N = smd 1.27 x 0.559: 1 -1.295,0.94; 2 -1.295,0; 3 -1.295,-0.94; 4 1.295,-0.94; 5 1.295,0.94
DO214AC = smd 1.8 x 1.7: A 2.05,0; C -2.05,0
SOT23-6 = smd 1.25 x 0.6: 1 -1.25,0.95; 2 -1.25,0; 3 -1.25,-0.95; 4 1.25,-0.95; 5 1.25,0; 6 1.25,0.95
TE_RUUVILIITIN2 = drill 1.1 pad 2 square: 1 0,0 | drill 1.1 pad 2: 2 5.08,0
MPT0.5/8-2.54 = drill 1.143 square: 1 0,0 | drill 1.143: 2 2.54,0; 3 5.08,0; 4 7.62,0; 5 10.16,0; 6 12.7,0; 7 15.24,0; 8 17.78,0
PIIKKIRIMA-3 = drill 1.016 square: 1 0,0 | drill 1.016: 2 2.54,0; 3 5.08,0
U.FL-R-SMT-1 = smd 1.05 x 2.2: GND1 -1.5,0; GND2 1.5,0 | smd 1 x 1.05: SIG 0,-1.525
PIIKKIRIMA-5 = drill 1.016 square: 1 0,0 | drill 1.016: 2 2.54,0; 3 5.08,0; 4 7.62,0; 5 10.16,0
PTH-2.6-5.5SQ = drill 2.6 pad 5.45 square: 1 0,0

### Placement (x,y rotation side)
A1  9.31,47.21 270 top
C1  9.4,18.5 270 top
C2  7.4,18.5 270 top
C3  23.5,46.5 90 top
C4  37,15 0 top
C5  33.6,15 180 top
C6  3.9,14.5 0 top
C7  2.9,16.5 0 top
C8  31,15 0 top
C9  41.7,33.7 0 top
C10  28,15 180 top
C11  24.5,26.5 0 top
C12  39.5,20.5 0 top
C13  40,36.5 0 top
C14  41.6,27.6 0 top
C15  27,24.5 180 top
C16  27,36.5 180 top
C17  39.5,19 0 top
C18  43,40 270 top
C19  27,38.5 180 top
C23  27.2,22.1 90 top
C24  33,20.5 270 top
C47  13.1,19.3 90 top
C49  47.9,16.7 0 top
C53  15,10.5 270 top
D1  33.4,30.39 0 top
D2  43.7,19 270 top
D3  21,23.5 0 top
D4  39.5,42.5 270 top
D5  26.5,43 270 top
D10  11,24.1 90 top
F1  11,10 180 top
G1  29.8,20.5 270 top
H1  31,47.5 90 top
H2  32.5,47.5 90 top
H3  34,47.5 90 top
H4  35.5,47.5 90 top
L1  4.4,25 180 top
L2  39.5,17.5 0 top
L3  6.5,35 90 top
N1  2.9,19.5 270 top
R1  5.4,20 270 top
R2  5.4,17 270 top
R3  20.9,18 0 top
R4  33.5,10 270 top
R5  36,10 270 top
R6  27,47.7 0 top
R7  6.5,37.5 0 top
R8  23.5,33.5 270 top
R9  37,13.5 180 top
R10  33.6,13.5 0 top
R11  15,13.5 0 top
R12  18,18 0 top
R13  24,13.5 0 top
R14  28.5,10 270 top
R15  31,10 270 top
R16  13.9,22.4 90 top
R17  31,13.5 180 top
R18  43,43 270 top
R19  24.6,28.3 0 top
R20  41.5,32.2 180 top
R21  28,13.5 0 top
R22  27,49 0 top
R23  38.5,49 180 top
R26  38.5,47.7 180 top
R27  22.4,27.6 270 top
R30  19.3,27.6 270 top
R35  9,14.5 0 top
R36  11.8,19.3 270 top
R42  45,26 180 top
R47  45,28.5 180 top
R58  43.5,13.8 180 top
R59  48,19 180 top
U$1  [DAFUG]  11,46 0 bottom
U$5  3.4,40.87 0 top
V2  19.5,13.5 270 top
V3  15,16.5 0 top
V5  24,16.5 0 top
V8  18.5,6.5 90 top
V10  21,6.5 90 top
V16  4.6,10 180 top
V23  43.5,10.3 0 top
V27  25,10 90 top
X1  9,4 0 top
X2  24.5,3.5 0 top
X3  48.5,41.28 270 top
X4  3,34.3 90 top
X5  48.5,23.5 90 top
Y1  3,3 0 top
Y2  47,3 0 top
Y3  47,47 0 top
Y4  3,47 0 top

### Tracks (layer width: path | path; a pad name or v marks a point on that pad's centre or on a via)
+3V3  (via drill 0.4)
  Top 0.3: 27.61,26.61 27.75,26.46 C15.1 28.1,24.5 28.4,24.2 29.29,24.2 D1.1 | 27.61,26.61 D1.64 27.76,26.64 27.8,26.6 27.8,26.2 27,25.4 D3.8 23.36,25.76 23.6,26 23.6,26.35 C11.1 23.38,26.88 R27.2 | D1.19 40.81,27.64 C14.1 | C13.1 39.23,36.48 D1.32 38.14,34.14 v37.2,33.6 | R1.1 5.88,20.73 6.2,20.4 7.2,20.4 7.4,20.2 | 9.2,21.2 9.9,21.9 D10.3 13.5,24.1 13.9,23.7 R16.2 | C16.1 27.8,36.5 | 27.8,36.5 29.36,36.5 D1.48 | D5.8 27.66,38.59 C19.1 27.75,36.55 27.8,36.5 | H4.A 36.45,46.75 36.6,46.6 43,46.6 43.8,45.8 43.8,42 v44.6,41.2 | R30.2 20.52,26.88 v20.6,26.8 | v29.6,27.4 28.8,26.6 27.6,26.6 27.61,26.61
  Top 0.4: D2.8 47.09,16.64 C49.1 | D4.8 42.14,40.14 42.75,40.75 C18.1 43,40.8 R18.2
  Top 0.5: v40.8,26.4 40.8,27.55 C14.1 | v34.2,27.8 34.2,33.2 | 34.2,33.2 34.6,33.6 v37.2,33.6 | v44.6,41.2 43.4,41.2 43,40.8 | 34.2,33.2 33.6,33.8 v31.6,33.8 | v28.6,37.4 27.8,36.6 27.8,36.5 27.8,36.4 | L2.2 40.5,17.5 v41.4,18.4 45.8,18.4 46.4,17.8 46.8,17.8 47.15,17.45 C49.1
  Top 0.55: 9.4,21 9.2,21.2 9,21.4 | C2.1 7.4,20.2
  Top 0.75: L1.1 6.05,21.95 6.6,21.4 7.4,21.4 | 7.4,21.4 9,21.4 | C1.1 9.4,21 9.8,21.4 v11,21.4 | 7.4,20.2 7.4,21.4 | A1.23 23.14,46.11 C3.1 24.25,45.75 v24.4,45.6
  Bottom 0.5: 14.8,26.8 v20.6,26.8 25.4,26.8 25.8,27.2 29.4,27.2 v29.6,27.4 30,27.2 32.6,27.2 33.2,27.8 v34.2,27.8 39.4,27.8 v40.8,26.4 | v37.2,33.6 37.8,34 37.8,39.6 39.4,41.2 v44.6,41.2 | v31.6,33.8 30.4,33.8 28.6,35.6 v28.6,37.4 | X5.1 43.7,23.5 v40.8,26.4 | v41.4,18.4 41.4,25.8 v40.8,26.4
  Bottom 0.75: v24.4,45.6 15.8,45.6 14.8,44.6 14.8,26.8 14.8,25.2 v11,21.4
+12V  (via drill 0.5)
  Top 0.5: R3.2 21.41,17.78 V2.1 21.41,14.01 21,13.6 18.8,13.6 | R12.2 18.6,18 18.86,17.73 V2.3 18.86,13.66 18.8,13.6 | 16.4,12.4 15.2,12.4 15,12.2 C53.1 6.65,11.45 6.6,11.4 6.6,11.6 6.4,11.8 7.58,12.98 R35.1 | 16.4,12.4 17.6,13.6 18.8,13.6 | v16.6,9.4 16.6,12.2 16.4,12.4
  Top 0.55: N1.4 1.96,16.69 C7.1 2.15,15.85 2.2,15.8
  Top 0.7: 2.5,15.5 2.2,15.8
  Top 1: 2.5,15.5 C6.1 2.5,12.5 3,12 6.2,12 6.4,11.8 6.65,11.55 V16.C F1.2 9.8,10
  Bottom 0.5: X2.1 18.5,3.5 17,5 17,9 v16.6,9.4
+12V_IN
  Top 1: X1.2 14.08,5.92 12.4,7.6 12.4,10 F1.1
ACCLINKRX
  Top 0.2: D1.17 39.23,25.38 39.4,25.2 41.8,25.2 43.2,23.8 45,23.8 45.6,23.2 D2.1
ACCLINKTX
  Top 0.2: D2.4 41.8,24 41.4,24.4 37.31,24.4 D1.16
ACCLINKTXE
  Top 0.2: R59.2 44.6,19 44.34,19.27 D2.2 44.34,23.07 44.06,23.34 43.06,23.34 | D1.15 36.65,25.45 36.8,25.6 37.6,25.6 37.8,25.4 37.8,25 38,24.8 41.6,24.8 43.06,23.34 | D2.3 43.06,23.34
ACCRTXHI
  Top 0.5: D2.6 43.06,14.79 R58.2 42.08,9.67 V23.1 42.55,5.55 42,5 41.2,5 39.8,3.6 39.8,3.56 X2.7
ACCRTXLO
  Top 0.5: D2.7 44.34,14.39 R58.1 44.92,9.67 V23.2 44.45,8.85 43.4,7.8 43.4,4.6 42.3,3.5 X2.8
BOOT0
  Top 0.2: D1.60 26.44,28.64 25.9,28.1 R19.2
BOOT1
  Top 0.3: D1.28 40.72,32.14 R20.2
GND  (via drill 0.4)
  Top 0.3: D1.63 26.54,27.14 25.9,26.5 C11.2 25.25,27.15 25,27.4 24,27.4 23.88,27.52 R19.1 | D1.31 38.24,33.64 38.2,33.6 38.2,33.2 37.6,32.6 36.6,32.6 v36.4,32.4
  Top 0.4: A1.24 23.46,47.21 C3.2 | A1.13 22.59,33.21 23,32.8 23.48,32.8 R8.2
  Top 0.5: R2.2 3.88,16.27 C7.2 2.9,17.25 N1.2 | R2.2 5.4,14.6 C6.2 | R2.2 6.58,16.27 C2.2 C1.2
  other vias: 5.6,33 7.4,40.6 6.6,33 7.6,33 7.6,35.4 22.4,31.6 25,38.4 25,36.6 28.8,46 25.2,48.8 24.6,46.6 33.2,49.2 37.6,43 35,38.4 42,36.4 37.8,26.6 42.4,26.4 40.8,30 39.8,23.4 36.8,22.4 42.8,19.6 40.2,16.2 43.4,12.8 48.6,15.4 32.2,16.2 32.6,18.6 17,14.2 16.6,16.8 12.8,17.4 12.2,21 25,24.6 29,28.2 28.8,25 42.6,45.2 1,31.8 1,36.8 2.4,19.4 3.4,19.4 4.4,16.4 6.4,16 3.8,13.2 1,11.8 1,15.8 9.6,25.8 15.8,29.2 15.8,28.4 13.8,28.4 13.8,29.2 23.4,44.6 24.4,42.6 31,37.8 25,10 22.6,12.2 26,14 26.8,16.8 38,12 37,17.6 48.6,20.2 46.6,24.6 46.6,22.6 42.4,23 43.4,32.2 43.8,33.4 43.8,34.2 43.4,30.4 32.4,32.4 36.4,45.8 31,42.6
  pour Top: 0,50 0,0 50,0 50,50
  pour Bottom: 0,50 0,0 50,0 50,50
GPS1PPS
  Top 0.2: D1.41 33.15,44.85 33,45 31.8,45 31,45.8 H1.A 30.95,46.8 25.4,46.8 24.8,47.4 24.8,48 24.2,48.6 8,48.6 7.6,48.2 7.6,45.4 7.99,45.01 A1.3
GPSRF
  Top 0.5: A1.11 6.54,34.31 L3.1 4.55,34.27 X4.SIG
GPSRXD
  Top 0.2: A1.21 31.69,43.91 32.65,42.95 D1.42
GPSSCL
  Top 0.2: D5.6 26.37,41.23 25.89,41.71 A1.19
GPSSDA
  Top 0.2: A1.18 24.59,40.61 24.8,40.4 D5.5
GPSTXD
  Top 0.2: A1.20 23.41,42.81 24,43.4 31.4,43.4 32.15,42.65 D1.43
I2C1SCL
  Top 0.2: D1.58 18.64,29.64 18.4,29.4 18.4,28.4 | 18.4,28.4 18.4,26.4 18.2,26.2 17.4,26.2 17.2,26 17.2,24.4 17.46,24.14 D3.2 | R30.1 18.48,28.32 18.4,28.4
I2C1SDA
  Top 0.2: D3.1 21.41,25.41 21.6,25.6 21.6,28.4 | 21.6,28.4 21.6,28.8 21.94,29.14 D1.59 | R27.1 21.68,28.32 21.6,28.4
IN1
  Top 0.2: C10.1 28.75,16.95 29.2,17.4 33.8,17.4 34.2,17.8 34.2,22 33.15,23.05 D1.8
  Top 0.3: R14.1 28.5,12.5 28.73,12.72 R21.2 28.73,14.97 C10.1
IN2
  Top 0.2: C8.1 30.25,16.65 30.6,17 34,17 34.6,17.6 34.6,22.2 33.65,23.15 D1.9
  Top 0.3: R15.1 31,12.4 30.8,12.6 30.4,12.6 30.27,12.72 R17.2 30.27,14.93 30.2,15 C8.1
IN3
  Top 0.2: C5.1 34.35,16.75 35,17.4 35,22.4 34.15,23.25 D1.10
  Top 0.3: R4.1 33.5,12.5 33.6,12.6 34.2,12.6 34.33,12.72 R10.2 34.33,14.97 C5.1
IN4
  Top 0.2: C4.1 36.25,16.55 35.4,17.4 35.4,22.6 34.65,23.35 D1.11
  Top 0.3: R5.1 36,12.4 36.27,12.68 R9.2 36.27,14.97 C4.1
IN_CH3
  Top 0.2: V27.3 25.95,9.55 26.2,9.8 33.4,9.8 33.5,9.7 R4.2
  Top 0.5: X2.4 32.12,6.92 32.4,7.2 33.2,7.2 33.5,7.5 R4.2
IN_CH4
  Top 0.2: V27.4 25.95,10.45 26.2,10.2 35.8,10.2 36,10 R5.2
  Top 0.5: R5.2 36,7.4 35.8,7.2 35,7.2 34.66,6.86 X2.5
IO_CH1  (via drill 0.4)
  Top 0.2: V27.1 24,8.7 24,7.4 24.2,7.2 v27,7.2
  Top 0.5: R14.2 28.5,7.5 28.2,7.2 v27,7.2
  Top 0.75: V8.C 18.5,2.5 19.6,1.4 26.6,1.4 27.04,1.84 X2.2
  Bottom 0.2: 27,3.54 X2.2
  Bottom 0.5: v27,7.2 27,3.54
IO_CH2
  Top 0.2: V27.6 23.45,11.25 23.2,11 23.2,5.8 23.4,5.6
  Top 0.5: X2.3 29.58,6.98 29.8,7.2 30.8,7.2 31,7.4 R15.2
  Top 0.75: V10.C 22.25,4.45 22.6,4.8 22.6,5.4 22.8,5.6 23.4,5.6 28.8,5.6 29.58,4.82 X2.3
LED_GRN
  Top 0.2: D1.39 34.15,45.25 34,45.4 H3.A
LED_RED
  Top 0.2: D1.40 33.65,44.95 33.2,45.4 32.8,45.4 32.5,45.7 H2.A
MEAS12V  (via drill 0.4)
  Top 0.2: R35.2 11.5,14.5 11.8,14.8 R36.2 13.07,18.57 C47.1 13.15,18.55 14.8,20.2 20.6,20.2 v21,20.6 | D1.14 36.15,25.75 36.6,26.2 v36.6,27
  Bottom 0.2: v21,20.6 21.4,20.2 25.6,20.2 25.8,20.4 25.8,25.2 27.2,26.6 33.6,26.6 34,27 v36.6,27
N1_PHASE
  Top 0.55: N1.3 1.96,21.76 2.6,22.4 2.6,24.85 L1.2
N1_SENSE
  Top 0.3: N1.5 4.39,18.2 4.88,17.73 R2.1 R1.2
N$2
  Top 0.3: R23.2 34.2,49 34,48.8 H3.C
N$3
  Top 0.3: R22.2 32.2,49 32.5,48.7 H2.C
N$5
  Top 0.3: R26.2 37.1,47.7 36.55,48.25 H4.C
N$10
  Top 0.3: V2.2 20.14,17.93 20.2,18 R3.1 20.18,18.77 20.4,19 22.4,19 22.8,18.6 22.8,17.8 23,17.6 V5.3
N$11
  Top 0.3: V2.4 17.59,17.68 R12.1 16.6,18 16.2,17.6 V3.3
N$17
  Top 0.3: R6.2 29.1,47.7 29.65,48.25 H1.C
N$20
  Top 0.5: R7.1 5.78,36.83 6.5,36.1 L3.2
N$21
  Top 0.3: A1.14 23.41,34.31 R8.1
N$33
  Bottom 0.2: 9.87,29.86 arc-7 9.66,29.98 8.94,29.43 8.54,29.84 9.09,30.56 arc-23 8.76,31.34 7.86,31.46 7.86,32.04 8.76,32.16 arc-23 9.09,32.94 8.54,33.66 8.94,34.06 9.66,33.52 arc-23 10.44,33.84 10.56,34.74 11.14,34.74 11.26,33.84 arc-23 12.04,33.52 12.76,34.06 13.16,33.66 12.62,32.94 arc-23 12.94,32.16 13.84,32.04 13.84,31.46 12.94,31.34 arc-23 12.62,30.56 13.16,29.84 12.76,29.43 12.04,29.98 arc-7 11.83,29.86 11.3,30.89 arc62 11.82,31.75 arc242 10.4,30.89 9.87,29.86
NERT
  Top 0.2: 18.2,10.8 18.2,11.14
  Top 0.4: V2.5 18.2,11.14 V2.6
  Top 1: V8.A 18.5,8.9 18.2,9.2 18.2,10.8
NERT1
  Top 0.2: 20.8,10.8 20.8,11.14
  Top 0.4: V2.8 20.8,11.14 20.34,11.14 20.2,11 20.2,11.07 V2.7
  Top 1: V10.A 21,8.6 20.8,8.8 20.8,10.8
OSCIN
  Top 0.2: D1.5 31.65,23.45 31.4,23.2 28.8,23.2 28.6,23 28.6,21.8 | 28,21.8 28.6,21.8 | 28.6,21.8 G1.1 | C23.1 28.35,21.35 28.6,21.8
OSCOUT
  Top 0.2: D1.6 32.15,21.4 | 32.15,21.4 32.15,19.55 32,19.4 31.3,19.4 G1.3 | C24.1 32.2,21.25 32.15,21.4
OUT1  (via drill 0.4)
  Top 0.2: V3.1 14.05,18.85 15,19.8 23.4,19.8 v23.8,19.4 | D1.24 35.94,30.14 35.6,29.8 v35.6,26.2
  Top 0.3: R11.1 14.28,14.12 14,14.4 14,15.4 V3.1
  Bottom 0.2: v23.8,19.4 25.8,19.4 26.2,19.8 26.2,25 27.4,26.2 34,26.2 34.4,26.6 35.2,26.6 v35.6,26.2
OUT2  (via drill 0.4)
  Top 0.2: V5.1 23.05,15.85 23.6,16.4 24.6,16.4 25.4,17.2 v25.4,18.2 | v34.6,25.8 34.6,26.2 35.2,26.8 35.2,30.2 35.64,30.64 D1.25
  Top 0.3: R13.1 23.27,14.32 23.05,14.55 V5.1
  Bottom 0.2: v25.4,18.2 25.4,18.4 26.6,19.6 26.6,24.8 27.6,25.8 v34.6,25.8
RESETL  (via drill 0.4)
  Top 0.2: R16.1 13.9,20.7 14,20.6 20,20.6 20.8,21.4 21.4,21.4 22.6,20.2 24.4,20.2 26.8,17.8 33.6,17.8 33.8,18 33.8,21.8 32.65,22.95 D1.7 32.65,31.05 v32.8,31.2
  Top 0.3: D10.1 12.1,22.1 12.53,21.68 R16.1
  Bottom 0.2: 48.44,33.6 X5.5 46.04,31.2 v32.8,31.2
SPI2CLK
  Top 0.2: D1.34 36.65,37.65 37.4,38.4 38.6,38.4 38.87,38.66 D4.6
SPI2CSN
  Top 0.2: D1.33 37.15,37.55 37.6,38 39.14,38 39.5,38.35 39.5,41.5 39.8,41.8 41.2,41.8 41.4,42 41.4,43.8 | 41.4,43.8 41.4,45 | R18.1 41.48,43.73 41.4,43.8
  Top 0.3: D4.1 41.41,44.99 41.4,45
SPI2MISO
  Top 0.2: D1.35 36.15,37.75 37.2,38.8 38,38.8 38.2,39 38.2,42 38.6,42.4 39.8,42.4 40.13,42.73 D4.2
SPI2MOSI
  Top 0.2: D1.36 35.65,37.85 37,39.2 37,39.8 37.34,40.14 D4.5
SWCLK
  Top 0.4: X5.3 45.8,28.58 R47.1
SWCLK_CPU  (via drill 0.4)
  Top 0.2: D1.49 29.26,34.14 29.6,33.8 29.6,29 v29.8,29 | v43.2,29 43.7,28.5 R47.2
  Bottom 0.2: v29.8,29 v43.2,29
SWDIO
  Top 0.4: X5.2 45.84,26.04 45.8,26 R42.1
SWDIO_CPU  (via drill 0.4)
  Top 0.2: R42.2 44.27,26.73 44,27 43.6,27 v43.4,27.2 | v30.8,28 30.8,34 30.65,34.15 D1.46
  Bottom 0.2: v43.4,27.2 43.2,27.4 42.2,28.6 31.4,28.6 v30.8,28
USART6RX
  Top 0.2: D1.45 31.15,35.05 31.8,34.4 37.6,34.4 38.2,35 38.2,37 38.4,37.2 39.8,37.2 40.6,38 45.8,38 46.54,38.74 X3.2
USART6TX
  Top 0.2: D1.44 31.65,35.15 32,34.8 37.4,34.8 37.8,35.2 37.8,37.2 38.2,37.6 39.4,37.6 40.2,38.4 45.6,38.4 46.2,39 46.2,40.8 46.68,41.28 X3.1
VCAP1
  Top 0.3: D1.30 40.19,33.14 C9.1
VCCRF
  Top 0.5: A1.9 8.21,36.51 R7.2 7.33,37.61 A1.8
VDDA
  Top 0.3: D1.13 35.65,23.75 36,23.4 38,23.4 38.75,22.65 C12.1
  Top 0.4: L2.1 38.77,18.98 C17.1 C12.1

### Text on the board
tPlace: PPS | ERR | RUN | PWR
bPlace: TX | RX | TELAKONE GPS / V1.00 / KIMMOLI 2016 | GND | RSTL | GND | SWCLK | SWDIO | +3V3 | GND | +12V | +12V | IOCH1 | IOCH2 | IOCH3 | IOCH4 | GND | RTXH | RTXL